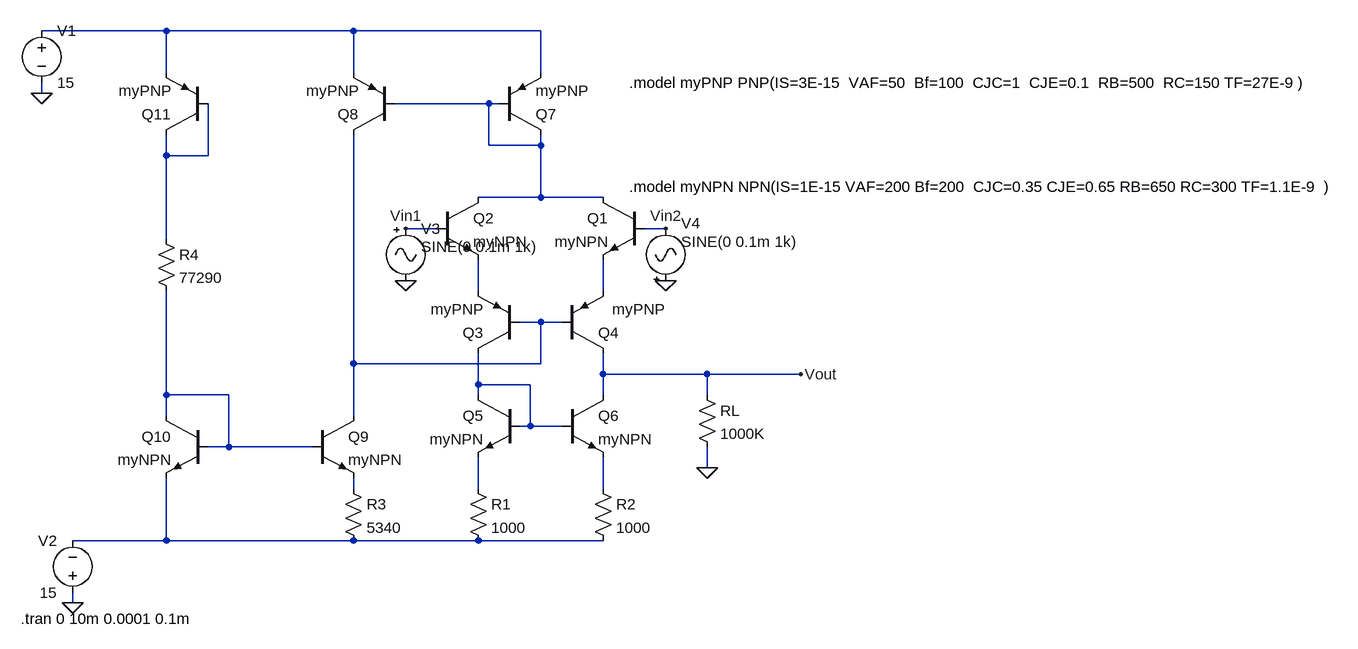
[diagram p0: schematic Elec2-project1.asc]
Elec2-project1.asc, the LTspice schematic file:
Version 4
SHEET 1 1672 680
WIRE -336 -512 -528 -512
WIRE -48 -512 -336 -512
WIRE 240 -512 -48 -512
WIRE -336 -448 -336 -512
WIRE -48 -448 -48 -512
WIRE 240 -448 240 -512
WIRE -528 -416 -528 -432
WIRE 160 -400 16 -400
WIRE 176 -400 160 -400
WIRE 160 -336 160 -400
WIRE 240 -336 240 -352
WIRE 240 -336 160 -336
WIRE -336 -320 -336 -352
WIRE -272 -320 -272 -400
WIRE -272 -320 -336 -320
WIRE 240 -256 240 -336
WIRE 240 -256 144 -256
WIRE 336 -256 240 -256
WIRE 80 -208 32 -208
WIRE 432 -208 400 -208
WIRE -336 -192 -336 -320
WIRE 144 -112 144 -160
WIRE 336 -112 336 -160
WIRE 240 -64 208 -64
WIRE 272 -64 240 -64
WIRE -48 0 -48 -352
WIRE 240 0 240 -64
WIRE 240 0 -48 0
WIRE 336 16 336 -16
WIRE 496 16 336 16
WIRE 640 16 496 16
WIRE 144 32 144 -16
WIRE 224 32 144 32
WIRE -336 48 -336 -112
WIRE -240 48 -336 48
WIRE 144 48 144 32
WIRE 336 48 336 16
WIRE 496 48 496 16
WIRE -336 80 -336 48
WIRE -48 80 -48 0
WIRE 224 96 224 32
WIRE 224 96 208 96
WIRE 272 96 224 96
WIRE -240 128 -240 48
WIRE -240 128 -272 128
WIRE -112 128 -240 128
WIRE 496 160 496 128
WIRE -48 192 -48 176
WIRE 144 192 144 144
WIRE 336 192 336 144
WIRE -336 272 -336 176
WIRE -336 272 -480 272
WIRE -48 272 -336 272
WIRE 144 272 -48 272
WIRE 336 272 144 272
WIRE -480 368 -480 352
FLAG 496 160 0
FLAG -528 -416 0
FLAG -480 368 0
FLAG 432 -128 0
FLAG 32 -128 0
FLAG 640 16 Vout
FLAG 432 -208 Vin2
FLAG 32 -208 Vin1
DATAFLAG -336 -320 ""
DATAFLAG 416 -208 ""
DATAFLAG 48 -208 ""
DATAFLAG 496 16 ""
DATAFLAG -336 -32 ""
DATAFLAG 128 -400 ""
DATAFLAG -48 -160 ""
DATAFLAG -48 192 ""
DATAFLAG -336 272 ""
DATAFLAG -336 -512 ""
DATAFLAG 240 -256 ""
DATAFLAG 144 32 ""
SYMBOL npn 400 -256 M0
SYMATTR InstName Q1
SYMATTR Value myNPN
SYMBOL npn 80 -256 R0
SYMATTR InstName Q2
SYMATTR Value myNPN
SYMBOL pnp 208 -16 R180
SYMATTR InstName Q3
SYMATTR Value myPNP
SYMBOL pnp 272 -16 M180
WINDOW 3 78 68 Left 2
SYMATTR Value myPNP
SYMATTR InstName Q4
SYMBOL npn 208 48 M0
SYMATTR InstName Q5
SYMATTR Value myNPN
SYMBOL npn 272 48 R0
SYMATTR InstName Q6
SYMATTR Value myNPN
SYMBOL res 128 176 R0
SYMATTR InstName R1
SYMATTR Value 1000
SYMBOL res 320 176 R0
SYMATTR InstName R2
SYMATTR Value 1000
SYMBOL pnp 176 -352 M180
SYMATTR InstName Q7
SYMATTR Value myPNP
SYMBOL pnp 16 -352 R180
SYMATTR InstName Q8
SYMATTR Value myPNP
SYMBOL npn -112 80 R0
SYMATTR InstName Q9
SYMATTR Value myNPN
SYMBOL npn -272 80 M0
SYMATTR InstName Q10
SYMATTR Value myNPN
SYMBOL res -64 176 R0
SYMATTR InstName R3
SYMATTR Value 5340
SYMBOL res -352 -208 R0
SYMATTR InstName R4
SYMATTR Value 77290
SYMBOL pnp -272 -352 R180
SYMATTR InstName Q11
SYMATTR Value myPNP
SYMBOL res 480 32 R0
SYMATTR InstName RL
SYMATTR Value 1000K
SYMBOL voltage -528 -528 R0
WINDOW 123 0 0 Left 0
WINDOW 39 0 0 Left 0
SYMATTR InstName V1
SYMATTR Value 15
SYMBOL voltage -480 368 R180
WINDOW 0 24 96 Left 2
WINDOW 3 24 16 Left 2
WINDOW 123 0 0 Left 0
WINDOW 39 0 0 Left 0
SYMATTR InstName V2
SYMATTR Value 15
SYMBOL Misc\\signal 32 -224 R0
WINDOW 3 24 44 Left 2
WINDOW 123 24 44 Left 2
WINDOW 39 0 0 Left 0
SYMATTR Value SINE(0 0.1m 1k)
SYMATTR InstName V3
SYMBOL Misc\\signal 432 -112 M180
WINDOW 0 24 104 Left 2
WINDOW 3 24 76 Left 2
WINDOW 123 24 76 Left 2
WINDOW 39 0 0 Left 0
SYMATTR InstName V4
SYMATTR Value SINE(0 0.1m 1k)
TEXT 376 -272 Left 2 !.model myNPN NPN(IS=1E-15 VAF=200 Bf=200  CJC=0.35 CJE=0.65 RB=650 RC=300 TF=1.1E-9  )
TEXT 376 -432 Left 2 !.model myPNP PNP(IS=3E-15  VAF=50  Bf=100  CJC=1  CJE=0.1  RB=500  RC=150 TF=27E-9 )
TEXT -560 392 Left 2 !.tran 0 10m 0.0001 0.1m

The netlist it stands for:
* Elec2-project1.asc
Q1 N002 Vin2 N005 0 myNPN
Q2 N002 Vin1 N004 0 myNPN
Q3 N007 N006 N004 0 myPNP
Q4 Vout N006 N005 0 myPNP
Q5 N007 N007 N010 0 myNPN
Q6 Vout N007 N011 0 myNPN
R1 N010 N012 1000
R2 N011 N012 1000
Q7 N002 N002 N001 0 myPNP
Q8 N006 N002 N001 0 myPNP
Q9 N006 N008 N009 0 myNPN
Q10 N008 N008 N012 0 myNPN
R3 N009 N012 5340
R4 N003 N008 77290
Q11 N003 N003 N001 0 myPNP
RL Vout 0 1000K
V1 N001 0 15
V2 0 N012 15
V3 Vin1 0 SINE(0 0.1m 1k)
V4 0 Vin2 SINE(0 0.1m 1k)
.model NPN NPN
.model PNP PNP
.lib standard.bjt
.model myNPN NPN(IS=1E-15 VAF=200 Bf=200  CJC=0.35 CJE=0.65 RB=650 RC=300 TF=1.1E-9  )
.model myPNP PNP(IS=3E-15  VAF=50  Bf=100  CJC=1  CJE=0.1  RB=500  RC=150 TF=27E-9 )
.tran 0 10m 0.0001 0.1m
.backanno
.end